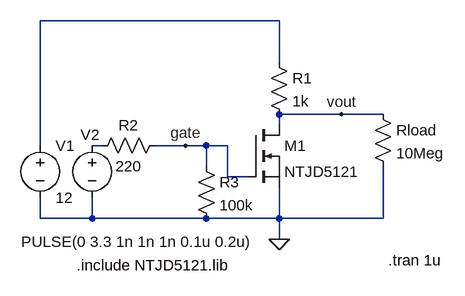
[diagram p0: schematic level_shift.asc]
level_shift.asc, the LTspice schematic file:
Version 4
SHEET 1 1156 680
WIRE 464 80 96 80
WIRE 464 144 464 80
WIRE 560 224 464 224
WIRE 624 224 560 224
WIRE 464 240 464 224
WIRE 96 272 96 80
WIRE 192 272 176 272
WIRE 320 272 272 272
WIRE 352 272 320 272
WIRE 384 272 352 272
WIRE 352 304 352 272
WIRE 384 320 384 272
WIRE 416 320 384 320
WIRE 96 384 96 352
WIRE 176 384 176 352
WIRE 176 384 96 384
WIRE 352 384 176 384
WIRE 464 384 464 336
WIRE 464 384 352 384
WIRE 624 384 624 304
WIRE 624 384 464 384
WIRE 464 416 464 384
FLAG 464 416 0
FLAG 560 224 vout
FLAG 320 272 gate
SYMBOL nmos 416 240 R0
SYMATTR InstName M1
SYMATTR Value NTJD5121
SYMATTR Prefix X
SYMBOL Voltage 96 256 R0
SYMATTR InstName V1
SYMATTR Value 12
SYMATTR SpiceLine Rser=0.1
SYMBOL Res 448 128 R0
SYMATTR InstName R1
SYMATTR Value 1k
SYMBOL Voltage 176 256 R0
WINDOW 0 -18 -1 Left 2
WINDOW 3 -109 164 Left 2
SYMATTR InstName V2
SYMATTR Value PULSE(0 3.3 1n 1n 1n 0.1u 0.2u)
SYMATTR SpiceLine Rser=0.1
SYMBOL Res 288 256 R90
WINDOW 0 0 56 VBottom 2
WINDOW 3 32 56 VTop 2
SYMATTR InstName R2
SYMATTR Value 220
SYMBOL Res 608 208 R0
SYMATTR InstName Rload
SYMATTR Value 10Meg
SYMBOL Res 336 288 R0
SYMATTR InstName R3
SYMATTR Value 100k
TEXT 152 456 Left 2 !.include NTJD5121.lib
TEXT 632 448 Left 2 !.tran 1u

The netlist it stands for:
* level_shift.asc
XM1 vout gate 0 NTJD5121  ; pins D G S
V1 N001 0 12 Rser=0.1
R1 N001 vout 1k
V2 N002 0 PULSE(0 3.3 1n 1n 1n 0.1u 0.2u) Rser=0.1
R2 gate N002 220
Rload vout 0 10Meg
R3 gate 0 100k
.include NTJD5121.lib
.tran 1u
.backanno
.end